# Altium schematic sheet Bluetooth.SchDoc
size A4
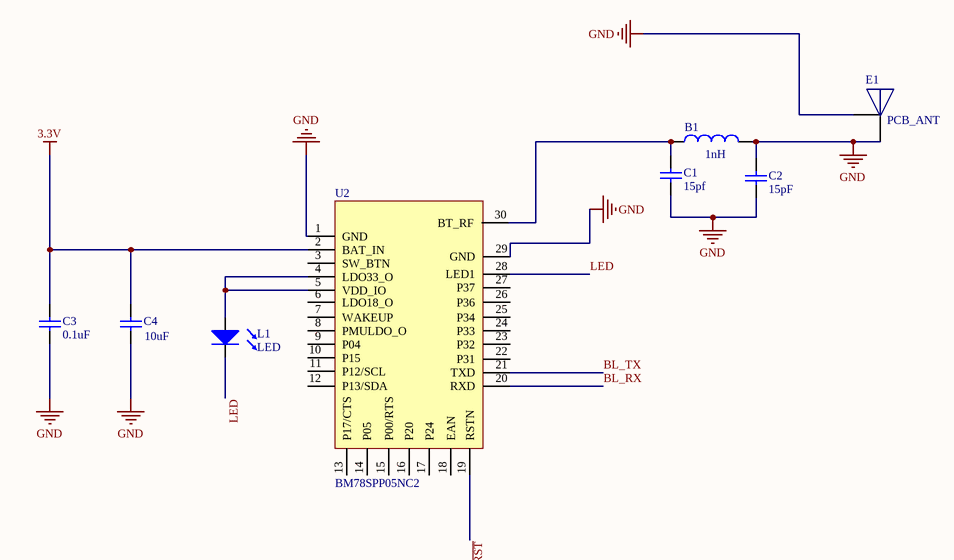
[diagram p0: Bluetooth.SchDoc]

## Parts
B1  1nH  [0805]
C1  15pf  [0603]
C2  15pF  [0603]
C3  0.1uF  [0603]
C4  10uF  [0603]
E1  PCB_ANT  [BM78SPP05NC2_ANT]
L1  LED  [0805]
U2  BM78SPP05NC2  [BM78SPP05NC2]

## Nets
3.3V: C3.2 C4.2 U2.2(BAT_IN)
GND: B1.2 C1.1 C2.1 C2.2 C3.1 C4.1 E1.1(ANT) E1.2(GND) U2.1(GND) U2.29(GND)
BL_RX: U2.20(RXD)
BL_TX: U2.21(TXD)
LED: L1.2(K) U2.28(LED1)
~{RST}: U2.19(RSTN)
NetB1_1: B1.1 C1.2 U2.30(BT_RF)
NetL1_1: L1.1(A) U2.4(LDO33_O) U2.5(VDD_IO)

Not connected (* = marked no-connect by the designer): U2 3(SW_BTN) 6(LDO18_O) 7(WAKEUP) 8(PMULDO_O) 9(P04) 10(P15) 11(P12/SCL) 12(P13/SDA) 13(P17/CTS) 14(P05) 15(P00/RTS) 16(P20) 17(P24) 18(EAN) 22(P31) 23(P32) 24(P33) 25(P34) 26(P36) 27(P37)

## Library data of the parts
B1 = Bead
C1-C4 = Cap1: ceramic